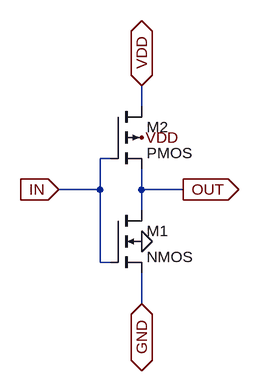
[diagram p0: schematic INV_INV.asc]
INV_INV.asc, the LTspice schematic file:
Version 4
SHEET 1 880 680
WIRE 224 64 224 32
WIRE 176 144 160 144
WIRE 160 192 160 144
WIRE 160 192 96 192
WIRE 224 192 224 160
WIRE 288 192 224 192
WIRE 224 224 224 192
WIRE 160 304 160 192
WIRE 176 304 160 304
WIRE 224 368 224 320
FLAG 224 112 VDD
FLAG 224 272 0
FLAG 96 192 IN
IOPIN 96 192 In
FLAG 288 192 OUT
IOPIN 288 192 Out
FLAG 224 32 VDD
IOPIN 224 32 BiDir
FLAG 224 368 GND
IOPIN 224 368 BiDir
SYMBOL nmos4 176 224 R0
SYMATTR InstName M1
SYMATTR Value2 l=180n w=220n
SYMBOL pmos4 176 64 R0
SYMATTR InstName M2
SYMATTR Value2 l=180n w=220n

The netlist it stands for:
* INV_INV.asc
M1 OUT IN GND 0 NMOS l=180n w=220n
M2 VDD IN OUT VDD PMOS l=180n w=220n
.model NMOS NMOS
.model PMOS PMOS
.lib standard.mos
.backanno
.end